# Altium schematic sheet LAN8870_PINOUT.SchDoc
size C; SheetNumber: 3; SheetTotal: 7
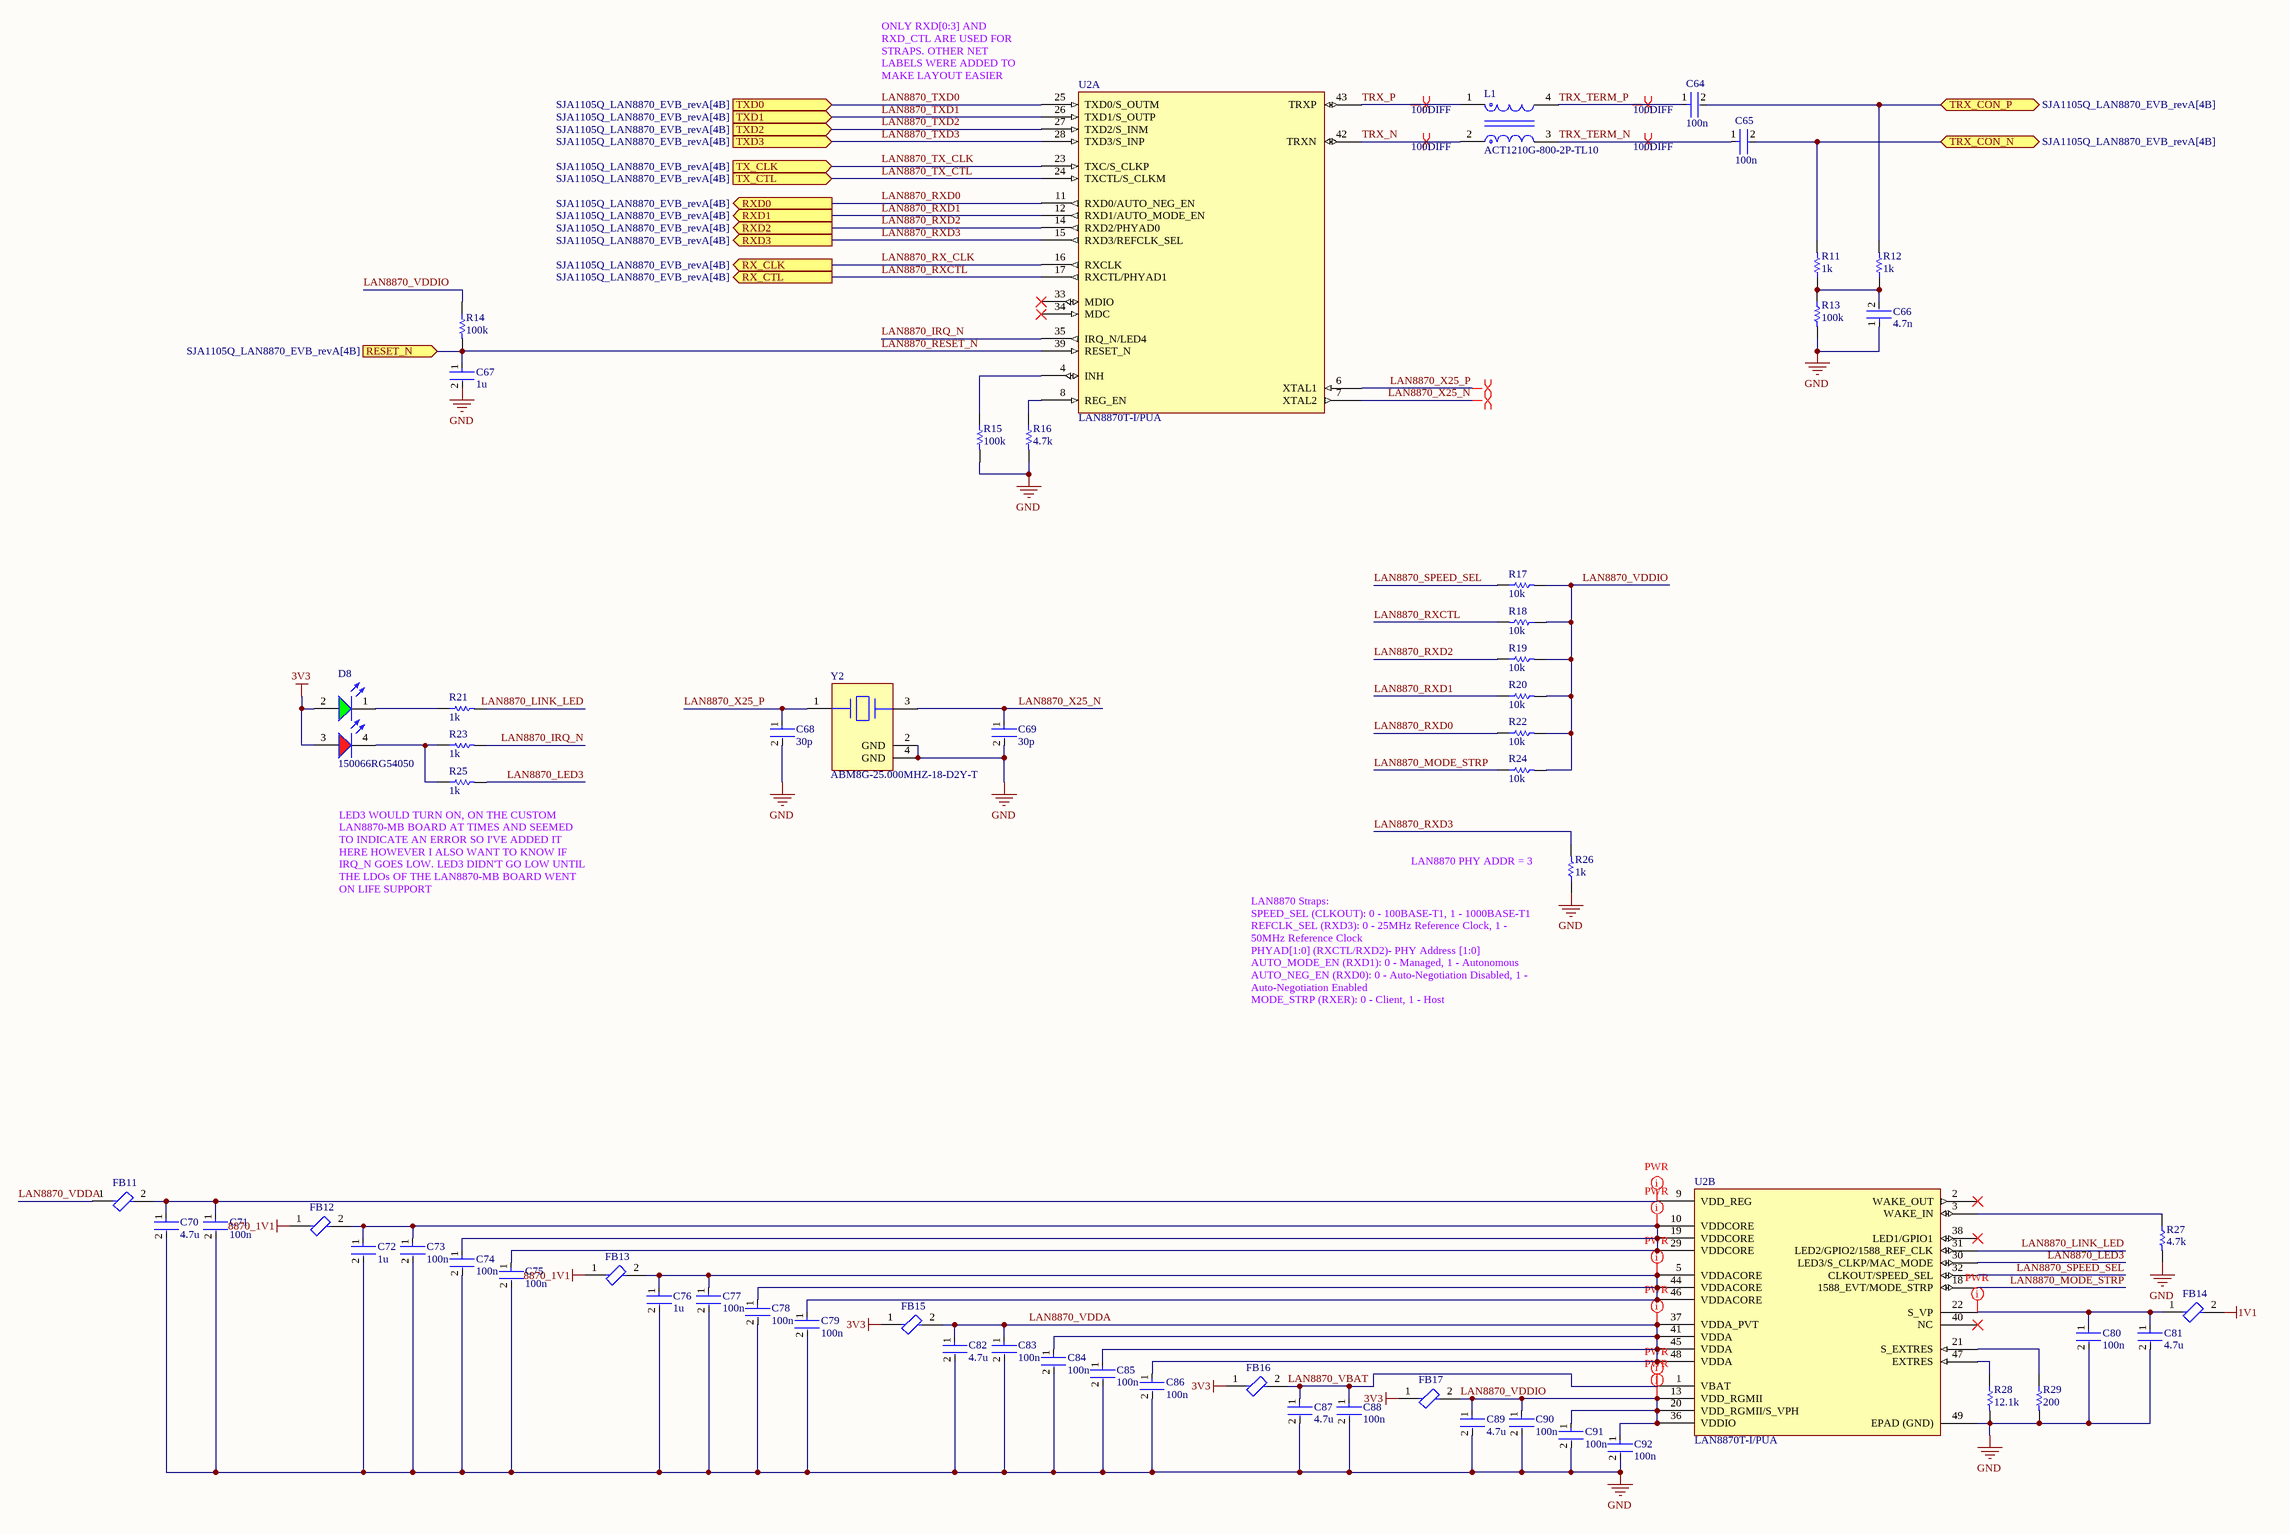
[diagram p0: LAN8870_PINOUT.SchDoc]

## Parts
C64  100n  [FP-0402-L_1_0_0_05-W_0_5-IPC_A]
C65  100n  [FP-0402-L_1_0_0_05-W_0_5-IPC_A]
C66  4.7n  [FP-0402-L_1_0_0_05-W_0_5-IPC_A]
C67  1u  [FP-0402-L_1_0_0_05-W_0_5-IPC_A]
C68  30p  [FP-0402-L_1_0_0_05-W_0_5-IPC_A]
C69  30p  [FP-0402-L_1_0_0_05-W_0_5-IPC_A]
C70  4.7u  [FP-0402-L_1_0_0_05-W_0_5-IPC_A]
C71  100n  [FP-0402-L_1_0_0_05-W_0_5-IPC_A]
C72  1u  [FP-0402-L_1_0_0_05-W_0_5-IPC_A]
C73  100n  [FP-0402-L_1_0_0_05-W_0_5-IPC_A]
C74  100n  [FP-0402-L_1_0_0_05-W_0_5-IPC_A]
C75  100n  [FP-0402-L_1_0_0_05-W_0_5-IPC_A]
C76  1u  [FP-0402-L_1_0_0_05-W_0_5-IPC_A]
C77  100n  [FP-0402-L_1_0_0_05-W_0_5-IPC_A]
C78  100n  [FP-0402-L_1_0_0_05-W_0_5-IPC_A]
C79  100n  [FP-0402-L_1_0_0_05-W_0_5-IPC_A]
C80  100n  [FP-0402-L_1_0_0_05-W_0_5-IPC_A]
C81  4.7u  [FP-0402-L_1_0_0_05-W_0_5-IPC_A]
C82  4.7u  [FP-0402-L_1_0_0_05-W_0_5-IPC_A]
C83  100n  [FP-0402-L_1_0_0_05-W_0_5-IPC_A]
C84  100n  [FP-0402-L_1_0_0_05-W_0_5-IPC_A]
C85  100n  [FP-0402-L_1_0_0_05-W_0_5-IPC_A]
C86  100n  [FP-0402-L_1_0_0_05-W_0_5-IPC_A]
C87  4.7u  [FP-0402-L_1_0_0_05-W_0_5-IPC_A]
C88  100n  [FP-0402-L_1_0_0_05-W_0_5-IPC_A]
C89  4.7u  [FP-0402-L_1_0_0_05-W_0_5-IPC_A]
C90  100n  [FP-0402-L_1_0_0_05-W_0_5-IPC_A]
C91  100n  [FP-0402-L_1_0_0_05-W_0_5-IPC_A]
C92  100n  [FP-0402-L_1_0_0_05-W_0_5-IPC_A]
D8  150066RG54050  [WL-SBCD_0606]
FB11  BLM18KG331SH1D  [FP-BLM18-0_15-t0_8-IPC_B]  (value not drawn)
FB12  BLM18KG331SH1D  [FP-BLM18-0_15-t0_8-IPC_B]  (value not drawn)
FB13  BLM18KG331SH1D  [FP-BLM18-0_15-t0_8-IPC_B]  (value not drawn)
FB14  BLM18KG331SH1D  [FP-BLM18-0_15-t0_8-IPC_B]  (value not drawn)
FB15  BLM18KG331SH1D  [FP-BLM18-0_15-t0_8-IPC_B]  (value not drawn)
FB16  BLM18KG331SH1D  [FP-BLM18-0_15-t0_8-IPC_B]  (value not drawn)
FB17  BLM18KG331SH1D  [FP-BLM18-0_15-t0_8-IPC_B]  (value not drawn)
L1  ACT1210G-800-2P-TL10  [FP-ACT1210G-800-2P-TL10-MFG]
R11  1k  [R0603B]
R12  1k  [R0603B]
R13  100k  [R0603B]
R14  100k  [R0603B]
R15  100k  [R0603B]
R16  4.7k  [R0603B]
R17  10k  [R0603B]
R18  10k  [R0603B]
R19  10k  [R0603B]
R20  10k  [R0603B]
R21  1k  [R0603B]
R22  10k  [R0603B]
R23  1k  [R0603B]
R24  10k  [R0603B]
R25  1k  [R0603B]
R26  1k  [R0603B]
R27  4.7k  [R0603B]
R28  12.1k  [R0603B]
R29  200  [R0603B]
U2  LAN8870T-I/PUA  [QFN50P700X700X100_HS-49N]  (parts A,B of 2)
Y2  ABM8G-25.000MHZ-18-D2Y-T  [FP-ABM8G-MFG]

## Ports
RESET_N (in, see SJA1105Q_LAN8870_EVB_revA[4B]), RX_CLK (out, see SJA1105Q_LAN8870_EVB_revA[4B]), RX_CTL (out, see SJA1105Q_LAN8870_EVB_revA[4B]), RXD0 (out, see SJA1105Q_LAN8870_EVB_revA[4B]), RXD1 (out, see SJA1105Q_LAN8870_EVB_revA[4B]), RXD2 (out, see SJA1105Q_LAN8870_EVB_revA[4B]), RXD3 (out, see SJA1105Q_LAN8870_EVB_revA[4B]), TRX_CON_N (bidir, see SJA1105Q_LAN8870_EVB_revA[4B]), TRX_CON_P (bidir, see SJA1105Q_LAN8870_EVB_revA[4B]), TX_CLK (in, see SJA1105Q_LAN8870_EVB_revA[4B]), TX_CTL (in, see SJA1105Q_LAN8870_EVB_revA[4B]), TXD0 (in, see SJA1105Q_LAN8870_EVB_revA[4B]), TXD1 (in, see SJA1105Q_LAN8870_EVB_revA[4B]), TXD2 (in, see SJA1105Q_LAN8870_EVB_revA[4B]), TXD3 (in, see SJA1105Q_LAN8870_EVB_revA[4B])

## Nets
1V1: FB14.2
3V3: D8.2(A) D8.3(A) FB15.1 FB16.1 FB17.1
8870_1V1: FB12.1 FB13.1
GND: C66.1 C67.2 C68.2 C69.2 C70.2 C71.2 C72.2 C73.2 C74.2 C75.2 C76.2 C77.2 C78.2 C79.2 C80.2 C81.2 C82.2 C83.2 C84.2 C85.2 C86.2 C87.2 C88.2 C89.2 C90.2 C91.2 C92.2 R13.2 R15.2 R16.2 R26.1 R27.2 R28.2 R29.2 U2.49(EPAD_(GND)) Y2.2(GND) Y2.4(GND)
LAN8870_IRQ_N: R23.2 U2.35(IRQ_N/LED4)
LAN8870_LED3: R25.2 U2.30(LED3/S_CLKP/MAC_MODE)
LAN8870_LINK_LED: R21.2 U2.31(LED2/GPIO2/1588_REF_CLK)
LAN8870_MODE_STRP: R24.1 U2.18(1588_EVT/MODE_STRP)
LAN8870_RESET_N: C67.1 R14.2 U2.39(RESET_N) ; port RESET_N
LAN8870_RX_CLK: U2.16(RXCLK) ; port RX_CLK
LAN8870_RXCTL: R18.2 U2.17(RXCTL/PHYAD1) ; port RX_CTL
LAN8870_RXD0: R22.1 U2.11(RXD0/AUTO_NEG_EN) ; port RXD0
LAN8870_RXD1: R20.1 U2.12(RXD1/AUTO_MODE_EN) ; port RXD1
LAN8870_RXD2: R19.1 U2.14(RXD2/PHYAD0) ; port RXD2
LAN8870_RXD3: R26.2 U2.15(RXD3/REFCLK_SEL) ; port RXD3
LAN8870_SPEED_SEL: R17.1 U2.32(CLKOUT/SPEED_SEL)
LAN8870_TX_CLK: U2.23(TXC/S_CLKP) ; port TX_CLK
LAN8870_TX_CTL: U2.24(TXCTL/S_CLKM) ; port TX_CTL
LAN8870_TXD0: U2.25(TXD0/S_OUTM) ; port TXD0
LAN8870_TXD1: U2.26(TXD1/S_OUTP) ; port TXD1
LAN8870_TXD2: U2.27(TXD2/S_INM) ; port TXD2
LAN8870_TXD3: U2.28(TXD3/S_INP) ; port TXD3
LAN8870_VBAT: C87.1 C88.1 FB16.2 U2.1(VBAT)
LAN8870_VDDA: C82.1 C83.1 C84.1 C85.1 C86.1 FB11.1 FB15.2 U2.37(VDDA_PVT) U2.41(VDDA) U2.45(VDDA) U2.48(VDDA)
LAN8870_VDDIO: C89.1 C90.1 C91.1 C92.1 FB17.2 R14.1 R17.2 R18.1 R19.2 R20.2 R22.2 R24.2 U2.13(VDD_RGMII) U2.20(VDD_RGMII/S_VPH) U2.36(VDDIO)
LAN8870_X25_N: C69.1 U2.7(XTAL2) Y2.3
LAN8870_X25_P: C68.1 U2.6(XTAL1) Y2.1
TRX_CON_N: C65.2 R11.2 ; port TRX_CON_N
TRX_CON_P: C64.2 R12.2 ; port TRX_CON_P
TRX_N: L1.2 U2.42(TRXN)
TRX_P: L1.1 U2.43(TRXP)
TRX_TERM_N: C65.1 L1.3
TRX_TERM_P: C64.1 L1.4
NetC66_2: C66.2 R11.1 R12.1 R13.1
NetC70_1: C70.1 C71.1 FB11.2 U2.9(VDD_REG)
NetC72_1: C72.1 C73.1 C74.1 C75.1 FB12.2 U2.10(VDDCORE) U2.19(VDDCORE) U2.29(VDDCORE)
NetC76_1: C76.1 C77.1 C78.1 C79.1 FB13.2 U2.5(VDDACORE) U2.44(VDDACORE) U2.46(VDDACORE)
NetC80_1: C80.1 C81.1 FB14.1 U2.22(S_VP)
NetD8_1: D8.1(K) R21.1
NetD8_4: D8.4(K) R23.1 R25.1
NetR15_1: R15.1 U2.4(INH)
NetR16_1: R16.1 U2.8(REG_EN)
NetR27_1: R27.1 U2.3(WAKE_IN)
NetR28_1: R28.1 U2.47(EXTRES)
NetR29_1: R29.1 U2.21(S_EXTRES)

Not connected (* = marked no-connect by the designer): U2 2(WAKE_OUT)* 33(MDIO)* 34(MDC)* 38(LED1/GPIO1)* 40(NC)*

## Layout directives
differential pair; differential pair class 100DIFF: TRX_N, TRX_P, TRX_TERM_N, TRX_TERM_P
differential pair: LAN8870_X25_N, LAN8870_X25_P
net class PWR: LAN8870_VBAT, LAN8870_VDDA, LAN8870_VDDIO, NetC70_1, NetC72_1, NetC76_1, NetC80_1

## Notes on the sheet
- ONLY RXD[0:3] AND RXD_CTL ARE USED FOR STRAPS. OTHER NET LABELS WERE ADDED TO MAKE LAYOUT EASIER
- LAN8870 PHY ADDR = 3
- (near R25) LED3 WOULD TURN ON, ON THE CUSTOM LAN8870-MB BOARD AT TIMES AND SEEMED TO INDICATE AN ERROR SO I'VE ADDED IT HERE HOWEVER I ALSO WANT TO KNOW IF IRQ_N GOES LOW. LED3 DIDN'T GO LOW UNTIL THE LDOs OF THE LAN8870-MB BOARD WENT ON LIFE SUPPORT
- (near R26) LAN8870 Straps:
  SPEED_SEL (CLKOUT): 0 - 100BASE-T1, 1 - 1000BASE-T1
  REFCLK_SEL (RXD3): 0 - 25MHz Reference Clock, 1 - 50MHz Reference Clock
  PHYAD[1:0] (RXCTL/RXD2)- PHY Address [1:0]
  AUTO_MODE_EN (RXD1): 0 - Managed, 1 - Autonomous
  AUTO_NEG_EN (RXD0): 0 - Auto-Negotiation Disabled, 1 - Auto-Negotiation Enabled
  MODE_STRP (RXER): 0 - Client, 1 - Host

## Library data of the parts
C64-C92 = CMP-001-00058-1: LARGE PADS, 0402 CAP, CHANGE COMMENT TO MATCH REAL P/N; Capacitor Type: Ceramic; Min Operating Temperature: -55°C; Mounting Technology: Surface Mount; Pins: 2; Case/Package: 0402; RoHS Compliant: Yes; Max Operating Temperature: 85°C
D8 = CMP-004-00040-2: Led, Red/Grn, 180Mcd/230Mcd, 624Nm/525Nm Rohs Compliant: Yes; Source: rgled.SchLib; Component Type: Standard; Design Item ID: CMP-004-00034-2; Pins: 4
FB11-FB17 = CMP-06046-002069-1: Chip Ferrite Bead, 0603, 330Ω @ 100MHz, 0.08Ω, 25%, 1.7A; Number of Lines: 1; DC Resistance (DCR): 80mR; Packaging: Tape and Reel; Case/Package: 0603; Height: 0.037inch; Case Code (Metric): 1608; Length: 0.063inch; Package Quantity: 4000; Max Operating Temperature: 125°C; Case Code (Imperial): 0603; RoHS Compliant: Yes; Width: 0.032inch; Mount: Surface Mount; Min Operating Temperature: -55°C; Ratings: AEC-Q200; Max Current Rating: 1.7A
L1 = CMP-08256-000023-1: CMC 80UH 70MA 2LN 3.8KOHM SMD
R11 R12 R16-R29 = CMP-009-00002-14: Resistor; Value: 100k
R13-R15 = CMP-009-00002-14: Resistor; Value: 100k
U2 = CMP-015-00023-5: 100/1000BASE-T1 Rgmii/sgmii Phy; Case/Package: VQFN; Pins: 48
Y2 = CMP-2000-05733-3: Crystal 25MHz ±20ppm (Tol) ±30ppm (Stability) 18pF FUND 60Ω 4-Pin SMD T/R; Series Resistance: 60R; Length: 3.2mm; Depth: 2.5mm; Packaging: Tape and Reel; Min Operating Temperature: -40°C; Operating Frequency: 25 MHz; Lead Free: Lead Free; Number of Pins: 4; Frequency Tolerance: 20ppm; Radiation Hardening: No; Max Operating Temperature: 85°C; Termination: SMD/SMT; Frequency Stability: 30ppm; Frequency: 25MHz; Series: ABM8G; Mount: Surface Mount; Package Quantity: 1000; Height: 0.039inch; Width: 0.098inch; Case/Package: CSMD; ESR (Equivalent Series Resistance): 60R; Load Capacitance: 18pF; Tolerance: 20ppm